# EasyEDA Pro project OptoGrid_V0.05.eprj, board Programmer_V0.05
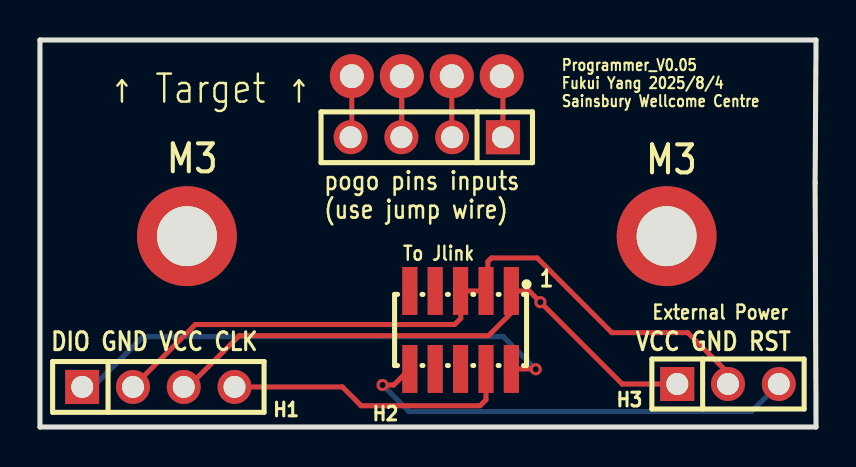
[diagram p9: board, top side]
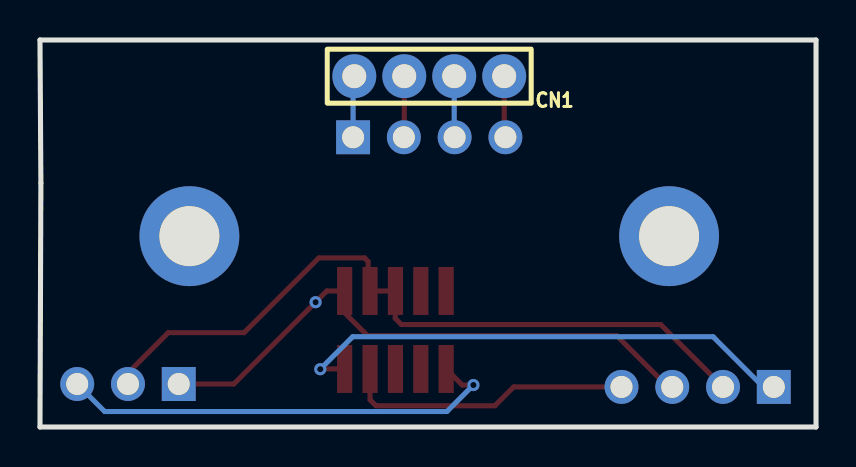
[diagram p10: board, bottom side, seen from below]

Outline 38.83 x 19.36 mm; copper layers: Top Layer, Bottom Layer. Coordinates in mm from the lower left corner of the outline.
Outline path: 0,19.36 0,0 38.83,0 38.78,12.21 38.83,19.36 0,19.36
Stack: Top Layer 0.035mm / Dielectric1 1.51mm FR4 er 4.5 / Bottom Layer 0.035mm

## Design rules (mm)
template: JLCPCB Capability(Two Layers Board)
spacing copperThickness1oz (default): track to track 0.102, other pairs 0.152 to 0.3
spacing copperThickness2oz: track to track 0.203, other pairs 0.152 to 0.3
track width copperThickness1oz (default): min 0.127, default 0.254, max 2.54
track width copperThickness2oz: min 0.203, default 0.254, max 2.54
differential pair differentialPair (default): width min 0.127, default 0.254, max 2.54; gap min 0.152, default 0.152
via viaSize (default): diameter min 0.5, default 0.61, max 10; hole min 0.3, default 0.305, max 6.3

## Placement (name value [footprint] x y rotation side)
CN1  YZ202715118P-04025-01  [BAT-TH_4P-P2.50_YZ202715118P-04025-01]  19.35 17.55 0 bottom
H1  2.54-1*4P母  [HDR-TH_4P-P2.54-V-F]  5.92 2.01 0 top
H2  20021121-00010C4LF  [HDR-SMD_10P-P1.27-V-M-R2-C5-S1.27-LS5.5]  21.04 4.85 180 top
H3  PZ254V-11-03P  [HDR-TH_3P-P2.54-V-M]  34.42 2.15 0 top
H4  2.54-1*4P母  [HDR-TH_4P-P2.54-V-F]  19.35 14.49 180 top
NOREF  -  [Pad_e3]  7.35 9.55 0 top
NOREF#2  -  [Pad_e5]  31.35 9.55 0 top

## Footprints (pads in the part's own frame, mm; a bottom-side part is the same pattern mirrored in y, then rotated)
BAT-TH_4P-P2.50_YZ202715118P-04025-01
  round 2.2 hole 1.2: 1(-3.75,0) 2(-1.25,0) 3(1.25,0) 4(3.75,0)
HDR-SMD_10P-P1.27-V-M-R2-C5-S1.27-LS5.5
  rect 0.76x2.4 smd: 1(-2.54,-1.95) 2(-2.54,1.95) 3(-1.27,-1.95) 4(-1.27,1.95) 5(0,-1.95) 6(0,1.95) 7(1.27,-1.95) 8(1.27,1.95) 9(2.54,-1.95) 10(2.54,1.95)
HDR-TH_3P-P2.54-V-M
  rect 1.7x1.7 hole 1.1: 1(-2.54,0)
  round 1.7 hole 1.1: 2(0,0) 3(2.54,0)
HDR-TH_4P-P2.54-V-F
  rect 1.7x1.7 hole 1.1: 1(-3.81,0)
  round 1.7 hole 1.1: 2(-1.27,0) 3(1.27,0) 4(3.81,0)
Pad_e3
  round 5 hole 3: 1(0,0)
Pad_e5
  round 5 hole 3: 1(0,0)

## Nets
As in the schematic.

Pads without a net: H2 6 7 8 9; NOREF 1; NOREF#2 1

## Via types
v1: diameter 0.61, hole 0.305, Top Layer to Bottom Layer, 3 vias

## Routing (per net, layer and track width the routed paths; a pad name or vN(x,y) marks a point on that pad's centre or on a via; arc(x,y) is an arc through that point)
GND: length 37
  Top Layer w0.254: H3.2 34.42,2.7 32.41,4.72 28.61,4.72 24.88,8.46 22.59,8.46 22.41,8.28 22.41,6.9 H2.3 H2.5 21.05,6.79 21.05,5.43 20.75,5.13 7.77,5.13 H1.2
VCC: length 29.2
  Top Layer w0.254: H3.1 29.13,2.15 v1(25.04,6.24) 24.48,6.8 H2.1 23.58,5.71 22.44,4.57 9.97,4.57 7.41,2.01 H1.3
RST: length 22.6
  Top Layer w0.254: v1(17.14,2.1) 17.7,2.1 H2.10
  Bottom Layer w0.254: v1(17.14,2.1) 18.47,0.77 35.59,0.77 H3.3
SWCLK: length 14.6
  Top Layer w0.254: H2.4 22.31,1.36 22.02,1.06 16.07,1.06 15.13,2.01 H1.4
SWDIO: length 25.6
  Top Layer w0.254: H2.2 24.79,2.9 v1(24.8,2.89)
  Bottom Layer w0.254: H1.1 2.64,2.01 5.15,4.52 23.18,4.52 v1(24.8,2.89)
$1N2057: length 3.1
  Top Layer w0.254: CN1.1 15.6,14.55 H4.4
$1N2061: length 6.1
  Top Layer w0.254: H4.3 18.1,14.51 CN1.2
  Bottom Layer w0.254: 18.1,14.49 CN1.2
$1N2065: length 3.1
  Top Layer w0.254: H4.2 20.6,14.51 CN1.3
$1N2069: length 6.2
  Top Layer w0.254: H4.1 23.16,17.49 CN1.4
  Bottom Layer w0.254: CN1.4 23.16,17.48 23.16,14.49

## Text on the board
Top Silkscreen Layer: Programmer_V0.05 / Fukui Yang 2025/8/4 / Sainsbury Wellcome Centre | To Jlink | External Power | 1 | pogo pins inputs / (use jump wire) | DIO GND VCC CLK | VCC GND RST | M3 | ↑ Target ↑
